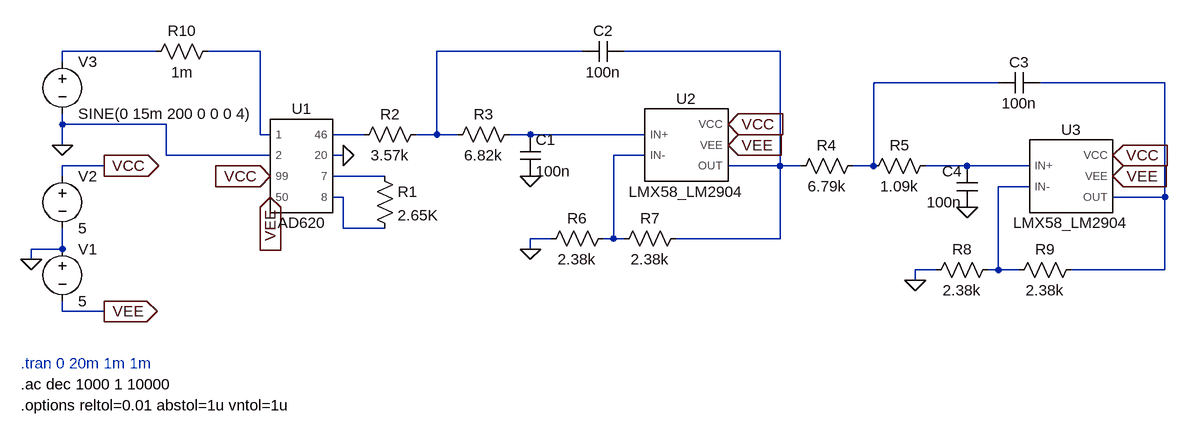
[diagram p0: schematic Draft1.asc]
Draft1.asc, the LTspice schematic file:
Version 4
SHEET 1 1416 680
WIRE -160 -16 -304 -16
WIRE 0 -16 -80 -16
WIRE 496 -16 272 -16
WIRE 800 -16 560 -16
WIRE -304 0 -304 -16
WIRE 1136 32 944 32
WIRE 1392 32 1200 32
WIRE -304 96 -304 80
WIRE -144 96 -304 96
WIRE 0 112 0 -16
WIRE 16 112 0 112
WIRE 160 112 112 112
WIRE 272 112 272 -16
WIRE 272 112 240 112
WIRE 304 112 272 112
WIRE 416 112 384 112
WIRE 592 112 416 112
WIRE -304 128 -304 96
WIRE -144 144 -144 96
WIRE 16 144 -144 144
WIRE 128 144 112 144
WIRE 592 144 544 144
WIRE -240 160 -304 160
WIRE 800 160 800 -16
WIRE 800 160 720 160
WIRE 832 160 800 160
WIRE 944 160 944 32
WIRE 944 160 912 160
WIRE 1088 160 1024 160
WIRE 1184 160 1088 160
WIRE -304 176 -304 160
WIRE 192 176 112 176
WIRE 1184 192 1136 192
WIRE 128 208 112 208
WIRE 1392 208 1392 32
WIRE 1392 208 1312 208
WIRE 128 256 128 208
WIRE 192 256 128 256
WIRE 448 272 416 272
WIRE 544 272 544 144
WIRE 544 272 528 272
WIRE 560 272 544 272
WIRE 800 272 800 160
WIRE 800 272 640 272
WIRE -304 288 -304 256
WIRE -304 288 -352 288
WIRE 416 288 416 272
WIRE -352 304 -352 288
WIRE 1040 320 1008 320
WIRE 1136 320 1136 192
WIRE 1136 320 1120 320
WIRE 1168 320 1136 320
WIRE 1392 320 1392 208
WIRE 1392 320 1248 320
WIRE 1008 336 1008 320
WIRE -304 384 -304 368
WIRE -240 384 -304 384
FLAG -352 304 0
FLAG -240 160 VCC
IOPIN -240 160 Out
FLAG -240 384 VEE
IOPIN -240 384 Out
FLAG 16 208 VEE
IOPIN 16 208 In
FLAG 16 176 VCC
IOPIN 16 176 In
FLAG 128 144 0
FLAG 720 128 VEE
IOPIN 720 128 In
FLAG 720 96 VCC
IOPIN 720 96 In
FLAG 1312 144 VCC
IOPIN 1312 144 In
FLAG 1312 176 VEE
IOPIN 1312 176 In
FLAG 1008 336 0
FLAG 416 288 0
FLAG -304 128 0
FLAG 416 176 0
FLAG 1088 224 0
SYMBOL AD620 64 160 R0
SYMATTR InstName U1
SYMBOL voltage -304 272 R0
WINDOW 123 0 0 Left 0
WINDOW 39 0 0 Left 0
SYMATTR InstName V1
SYMATTR Value 5
SYMBOL voltage -304 160 R0
WINDOW 123 0 0 Left 0
WINDOW 39 0 0 Left 0
SYMATTR InstName V2
SYMATTR Value 5
SYMBOL res 176 160 R0
SYMATTR InstName R1
SYMATTR Value 2.65K
SYMBOL res 256 96 R90
WINDOW 0 0 56 VBottom 2
WINDOW 3 32 56 VTop 2
SYMATTR InstName R2
SYMATTR Value 3.57k
SYMBOL res 400 96 R90
WINDOW 0 0 56 VBottom 2
WINDOW 3 32 56 VTop 2
SYMATTR InstName R3
SYMATTR Value 6.82k
SYMBOL LMX58_LM2904 656 128 R0
SYMATTR InstName U2
SYMBOL LMX58_LM2904 1248 176 R0
SYMATTR InstName U3
SYMBOL cap 400 112 R0
SYMATTR InstName C1
SYMATTR Value 100n
SYMBOL cap 560 -32 R90
WINDOW 0 0 32 VBottom 2
WINDOW 3 32 32 VTop 2
SYMATTR InstName C2
SYMATTR Value 100n
SYMBOL cap 1200 16 R90
WINDOW 0 0 32 VBottom 2
WINDOW 3 32 32 VTop 2
SYMATTR InstName C3
SYMATTR Value 100n
SYMBOL cap 1104 224 R180
WINDOW 0 24 56 Left 2
WINDOW 3 24 8 Left 2
SYMATTR InstName C4
SYMATTR Value 100n
SYMBOL res 928 144 R90
WINDOW 0 0 56 VBottom 2
WINDOW 3 32 56 VTop 2
SYMATTR InstName R4
SYMATTR Value 6.79k
SYMBOL res 1040 144 R90
WINDOW 0 0 56 VBottom 2
WINDOW 3 32 56 VTop 2
SYMATTR InstName R5
SYMATTR Value 1.09k
SYMBOL res 544 256 R90
WINDOW 0 0 56 VBottom 2
WINDOW 3 32 56 VTop 2
SYMATTR InstName R6
SYMATTR Value 2.38k
SYMBOL res 656 256 R90
WINDOW 0 0 56 VBottom 2
WINDOW 3 32 56 VTop 2
SYMATTR InstName R7
SYMATTR Value 2.38k
SYMBOL res 1136 304 R90
WINDOW 0 0 56 VBottom 2
WINDOW 3 32 56 VTop 2
SYMATTR InstName R8
SYMATTR Value 2.38k
SYMBOL res 1264 304 R90
WINDOW 0 0 56 VBottom 2
WINDOW 3 32 56 VTop 2
SYMATTR InstName R9
SYMATTR Value 2.38k
SYMBOL voltage -304 -16 R0
WINDOW 123 0 0 Left 0
WINDOW 39 0 0 Left 0
SYMATTR InstName V3
SYMATTR Value SINE(0 15m 200 0 0 0 4)
SYMBOL res -64 -32 R90
WINDOW 0 0 56 VBottom 2
WINDOW 3 32 56 VTop 2
SYMATTR InstName R10
SYMATTR Value 1m
TEXT -368 464 Left 2 ;.tran 0 20m 1m 1m
TEXT -368 528 Left 2 !.options reltol=0.01 abstol=1u vntol=1u
TEXT -368 496 Left 2 !.ac dec 1000 1 10000

The netlist it stands for:
* Draft1.asc
XU1 N002 0 VCC VEE N007 0 N011 N013 AD620  ; pins 1 2 99 50 46 20 7 8
V1 0 VEE 5
V2 VCC 0 5
R1 N011 N013 2.65K
R2 N003 N007 3.57k
R3 N008 N003 6.82k
XU2 N008 N009 VCC VEE N004 LMX58_LM2904  ; pins IN+ IN- VCC VEE OUT
XU3 N010 N012 VCC VEE N006 LMX58_LM2904  ; pins IN+ IN- VCC VEE OUT
C1 N008 0 100n
C2 N004 N003 100n
C3 N006 N005 100n
C4 0 N010 100n
R4 N005 N004 6.79k
R5 N010 N005 1.09k
R6 N009 0 2.38k
R7 N004 N009 2.38k
R8 N012 0 2.38k
R9 N006 N012 2.38k
V3 N001 0 SINE(0 15m 200 0 0 0 4)
R10 N002 N001 1m
* .tran 0 20m 1m 1m
.options reltol=0.01 abstol=1u vntol=1u
.ac dec 1000 1 10000
.lib Z:\home\david\Documents\LTspice\PCB_filter\ad620.cir
.lib Z:\home\david\Documents\LTspice\PCB_filter\LM2904\lmx58_lm2904.lib
.backanno
.end